# Altium schematic sheet Sheet2.SchDoc
size A; SheetNumber: 1; SheetTotal: 1
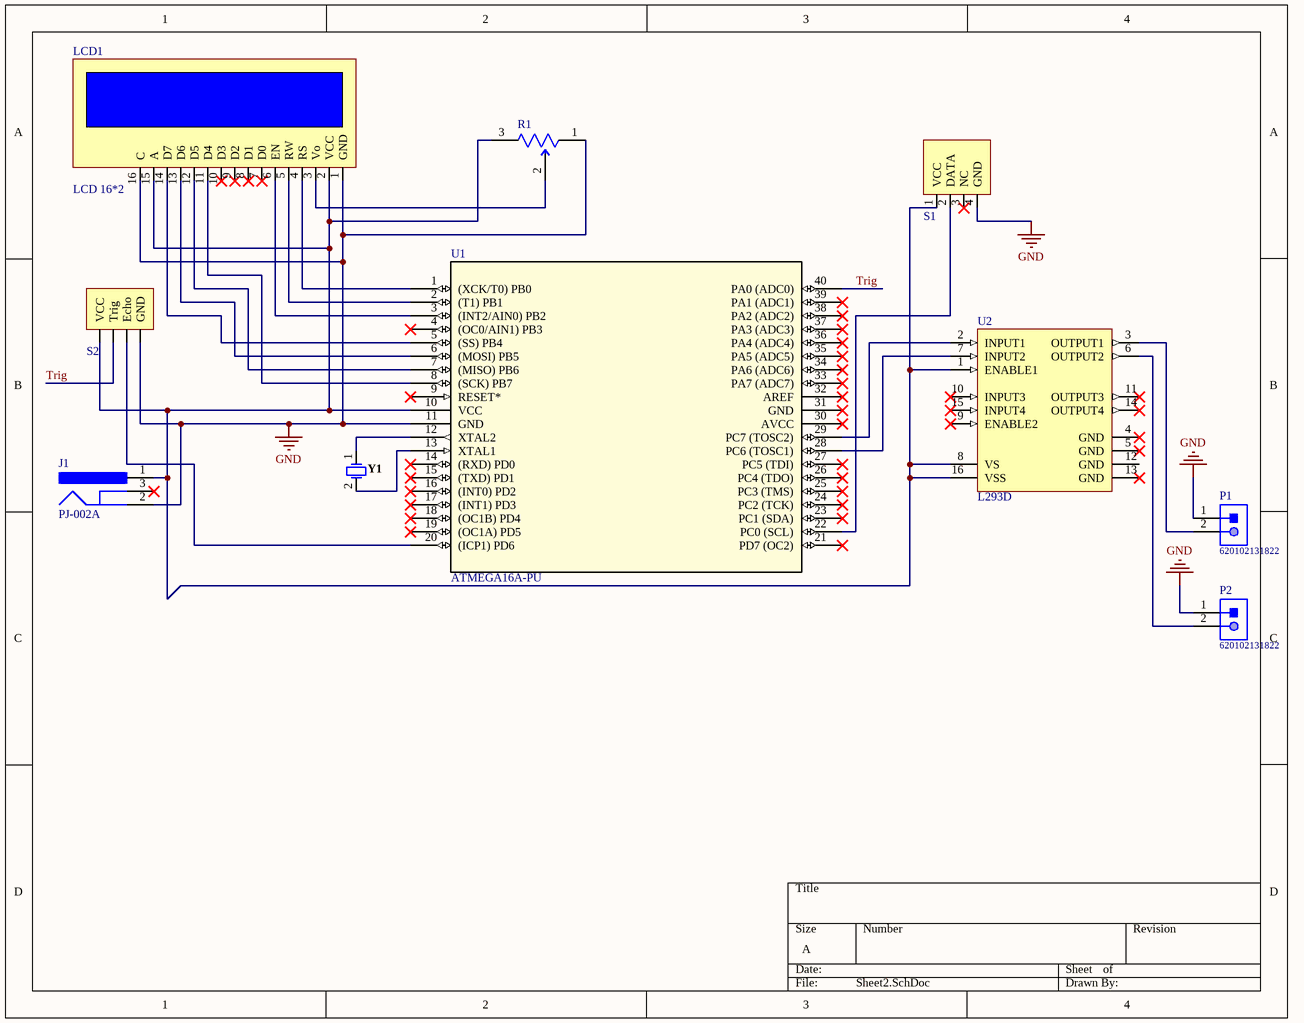
[diagram p0: Sheet2.SchDoc]

## Parts
J1  PJ-002A  [CUI-PJ-002A_V]
LCD1  LCD 16*2  [LCD1602]
P1  620102131822  [620102131822]
P2  620102131822  [620102131822]
R1  3006P-1-103LF  [FP-3006P-MFG]  (value not drawn)
S1  386  [DHT11]  (value not drawn)
S2  HC-SR04  [HC-SR04]  (value not drawn)
U1  ATMEGA16A-PU  [ATmega16A]
U2  L293D  [STM-L293D-16]
Y1  FOXSLF/080-20  [FOX-FOXSLF080-20]  (value not drawn)

## Nets
GND: J1.2 LCD1.1(GND) LCD1.16(C) P1.1 P2.1 R1.1(CCW) S1.4(GND) S2.4(GND) U1.11(GND)
Trig: S2.2(Trig) U1.40(PA0_(ADC0))
NetJ1_1: J1.1 LCD1.2(VCC) LCD1.15(A) R1.3(CW) S1.1(VCC) S2.1(VCC) U1.10(VCC) U2.1(ENABLE1) U2.8(VS) U2.16(VSS)
NetLCD1_3: LCD1.3(Vo) R1.2(WIPER)
NetLCD1_4: LCD1.4(RS) U1.1((XCK/T0)_PB0)
NetLCD1_5: LCD1.5(RW) U1.2((T1)_PB1)
NetLCD1_6: LCD1.6(EN) U1.3((INT2/AIN0)_PB2)
NetLCD1_11: LCD1.11(D4) U1.8((SCK)_PB7)
NetLCD1_12: LCD1.12(D5) U1.7((MISO)_PB6)
NetLCD1_13: LCD1.13(D6) U1.6((MOSI)_PB5)
NetLCD1_14: LCD1.14(D7) U1.5((SS)_PB4)
NetP1_2: P1.2 U2.3(OUTPUT1)
NetP2_2: P2.2 U2.6(OUTPUT2)
NetS1_2: S1.2(DATA) U1.22(PC0_(SCL))
NetS2_3: S2.3(Echo) U1.20((ICP1)_PD6)
NetU1_12: U1.12(XTAL2) Y1.1
NetU1_13: U1.13(XTAL1) Y1.2
NetU1_28: U1.28(PC6_(TOSC1)) U2.7(INPUT2)
NetU1_29: U1.29(PC7_(TOSC2)) U2.2(INPUT1)

Not connected (* = marked no-connect by the designer): J1 3*; LCD1 7(D0)* 8(D1)* 9(D2)* 10(D3)*; S1 3(NC)*; U1 4((OC0/AIN1)_PB3)* 9(RESET*)* 14((RXD)_PD0)* 15((TXD)_PD1)* 16((INT0)_PD2)* 17((INT1)_PD3)* 18((OC1B)_PD4)* 19((OC1A)_PD5)* 21(PD7_(OC2))* 23(PC1_(SDA))* 24(PC2_(TCK))* 25(PC3_(TMS))* 26(PC4_(TDO))* 27(PC5_(TDI))* 30(AVCC)* 31(GND)* 32(AREF)* 33(PA7_(ADC7))* 34(PA6_(ADC6))* 35(PA5_(ADC5))* 36(PA4_(ADC4))* 37(PA3_(ADC3))* 38(PA2_(ADC2))* 39(PA1_(ADC1))*; U2 4(GND)* 5(GND)* 9(ENABLE2)* 10(INPUT3)* 11(OUTPUT3)* 12(GND) 13(GND)* 14(OUTPUT4)* 15(INPUT4)*

## Library data of the parts
J1 = CMP-2000-06895-2: Through Hole Right Angle DC Power Jack, 2.5 A, 2 mm Center Pin, 3 Position, -25 to 85 degC, RoHS, Bulk; Manufacturer: CUIInc.; Brand: CUI; Inside Contact Diameter: 2mm; Voltage Rating: 24V; Outside Contact Diameter: 6.5mm; Current Rating: 2.5A; Insulation Resistance: 50MOhms; Contact Gender: Male; Connector Type: DCPowerJack; Datasheet Version: Rev. 1.03, 04/2016; Housing Material: PolybutyleneTerephthalate(PBT); Operating Temperature Range: -25Cto+85C; Termination Style: ThroughHole; Product Category: DCPowerConnectors; Mounting Technology: ThroughHole; Mounting Style: ThroughHole; Factory Pack Quantity: 500; Contact Plating: Nickel; Package Reference: PJ-002A; Mounting Angle: Right; Package Description: 3-Pin Through Hole Device, Body 14.4 x 9 mm, Height 11 mm; Flammability Rating: UL94V-0; Manufacturer URL: http://www.cui.com/; Product: Jacks; Contact Material: Copper; Datasheet URL: http://www.cui.com/product/resource/pj-002a.pdf; RoHS: True; Manufacturer: CUI; Manufacturer Part Number: PJ-002A
P1 P2 = CMP-1502-00669-1: Male Shrouded Header WR-WTB, SMT, Right Angled, pitch 2 mm, 1 x 2 position; Manufacturer: Wurth Elektronik; Manufacturer: Wurth Electronics; Position: 1x2; Working Voltage: 100VAC; Contact Resistance: 20mOhm; Pitch: 2mm; Packaging: TapeandReel; Part Number: 620102131822; Publisher: WurthElektronik; Mounting Technology: SMT; Manufacturer URL: http://www.we-online.de; Datasheet URL: https://katalog.we-online.de/em/datasheet/6201xx131822.pdf; Gender: Male; Operating Temperature: -25to85degC; Package Reference: 620102131822; Orientation: RightAngled; Manufacturer Part Number: 620102131822
R1 = CMP-07234-000047-1: TRIMMER 10KOHM 0.75W PC PIN SIDE; Manufacturer Series: 3006; Manufacturer: Bourns; Pin Diameter: 0.6mm; Resistance Tolerance: 10%; Actuator Type: SCREW; Number of Turns: 15; Insulation Resistance: 1GR; Pitch: 2.5mm; Power Rating: 750mW; Resistance Law: Linear; Temperature Coefficient: 100ppm/°C; Resistance: 10kR; Number of Terminals/Pins: 3; Actuator Orientation: Horizontal; Package Quantity: 100; Depth: 4.83mm; Width: 4.83mm; Termination: Pin; Packaging: Rail/Tube; Height: 6.35mm; Terminal Finish: Tin; Color: Blue; Thickness: 5.59mm; Lead Free: Lead Free; Min Operating Temperature: -55°C; Type: Potentiometer; Radiation Hardening: No; Weight: 0.04oz; Mount: Panel; RoHS Compliant: Yes; Length: 20.57mm; Tolerance: 10%; Number of Pins: 3; Taper: Linear; Military Standard: Not; Resistor Type: Cermet; Max Operating Temperature: 125°C; REACH SVHC: No SVHC; Technology: CERMET; Max Power Dissipation: 750mW; Series: 3006; Manufacturer Part Number: 3006P-1-103LF
S1 = 386: SENSOR HUMID/TEMP 5V DTL 5% MOD; Manufacturer: Adafruit Industries; Response Time: 1s; Sensor Type: Temperature; Output Type: Digital; Supplier 1: Arrow Electronics; Manufacturer Part Number: 386; RoHS: Yes; Category: Sensors; Stock 1: 15; Pricing 1: 1=5.00000 (USD); Mount: Chassis Mount; Min Operating Temperature: 0°C; Max Operating Temperature: 50°C; Series: -; Accuracy: 5%; ComponentLink1URL: https://media.digikey.com/pdf/Data%20Sheets/Adafruit%20PDFs/DHT11_ProdManual.pdf?src-supplier=Digi-Key; ComponentLink1Description: https://media.digikey.com/pdf/Data%20Sheets/Adafruit%20PDFs/DHT11_ProdManual.pdf?src-supplier=Digi-Key
S2 = HC-SR04: Ultrasonic Sensor Module, Rectangular, 20-4000 mm, 5 V, 15 mA, Arduino Compatible; Manufacturer: OSEPP; Supplier 1: Mouser; Manufacturer Part Number: HC-SR04; RoHS: Yes; Category: Sensors; Stock 1: 121; Pricing 1: 1=6.55000, 10=6.55000, 50=6.55000, 100=6.55000, 1000=6.55000, 10000=6.55000 (USD); ComponentLink1URL: http://www.alliedelec.com/m/d/24ef524bf2e055bb41c3e7d4403161f4.pdf?src-supplier=Allied+Electronics; ComponentLink1Description: http://www.alliedelec.com/m/d/24ef524bf2e055bb41c3e7d4403161f4.pdf?src-supplier=Allied+Electronics
U1 = ATMEGA16A-PU: 8-bit AVR MCU, 16 KB, 1024 Bytes, 16 MHz, 2.7 to 5.5V, PDIP-40, RoHS; Manufacturer: Microchip / Atmel; Frequency: 16MHz; Memory Type: FLASH; Memory Size: 16KB; Interface: I2C,SPI,UART,USART,2-Wire; RAM Size: 1KB; Min Supply Voltage: 2.7V; Number of I/Os: 32; Number of Timers/Counters: 3; Oscillator Type: Internal; Data Bus Width: 8b; Peripherals: Brown-out Detect/Reset,POR,PWM,WDT; Number of PWM Channels: 4; Number of ADC Channels: 8; Number of SPI Channels: 1; Watchdog Timer: Yes; Supplier 1: Newark; Manufacturer Part Number: ATMEGA16A-PU; RoHS: Yes; Category: Microcontrollers; Mount: Through Hole; Case/Package: PDIP; Number of Pins: 40; Contact Plating: Tin,Matte; Min Operating Temperature: -40°C; Max Operating Temperature: 85°C; Packaging: Rail/Tube; Core Architecture: AVR; Max Supply Voltage: 5.5V; Package Quantity: 10; Number of Programmable I/O: 32; Max Frequency: 16MHz; Series: AVR® ATmega; Number of I2C Channels: 1; Length: 52.58mm; Width: 13.97mm; Height: 4.445mm; Radiation Hardening: No; REACH SVHC: No SVHC; Lead Free: Lead Free; ComponentLink1URL: https://datasheet.ciiva.com/26860/getdatasheetpartid-464499-26860340.pdf?src-supplier=Verical; ComponentLink1Description: https://datasheet.ciiva.com/26860/getdatasheetpartid-464499-26860340.pdf?src-supplier=Verical; ComponentLink2URL: https://datasheet.ciiva.com/14633/0900766b80db4e44-14633395.pdf?src-supplier=Allied+Electronics; ComponentLink2Description: https://datasheet.ciiva.com/14633/0900766b80db4e44-14633395.pdf?src-supplier=Allied+Electronics; ComponentLink3URL: https://datasheet.ciiva.com/1157/466147-1157513.pdf?src-supplier=Element14; ComponentLink3Description: https://datasheet.ciiva.com/1157/466147-1157513.pdf?src-supplier=Element14
U2 = L293D: Push-Pull Four Channel Driver with Diode, 4.5 to 36 V, -40 to 150 degC, 16-Pin PDIP, RoHS, Tube; Manufacturer: STMicroelectronics; Number of Outputs: 4; Current - Peak Output: 1.2A; Current - Output / Channel: 600mA; Input Type: Non-Inverting; Other Related Documents: L293DViewAllSpecifications; Dynamic Catalog: HalfBridge; Voltage - Supply: 4.5V~36V; Other Names: 497-2936-5; Package / Case: 16-DIP(0.300",7.62mm); PartNumber: L293D; Operating Temperature: -40°C~150°C; Datasheet URL: http://www.st.com/st-web-ui/static/active/en/resource/technical/document/datasheet/CD00000059.pdf; Supplier Device Package: 16-PowerDIP; Packaging: Tube; Package Description: 16-Pin Thru-Hole Dual-In-Line, Body 20 x 6.85 mm, Pitch 2.54 mm; Standard Package: 25; Datasheet Version: 07/2003; On-State Resistance: -; Manufacturer URL: http://www.st.com/; Category: IntegratedCircuits(ICs); Family: PMIC-MOSFET,BridgeDrivers-InternalSwitch; Type: HalfBridge; Series: -; Mounting Technology: ThroughHole; Package Reference: DIP-16; Mounting Type: ThroughHole; Manufacturer Part Number: L293D
Y1 = CMP-1749-00002-1: Resistance Weld Thru-Hole Crystal, 8 MHz, -20 to 70 degC, 2-Pin THD, RoHS, Bulk; Manufacturer: Fox Electronics; Dropout Voltage: 2 V; Outputs: 1; Nominal Output Voltage: 5 V; Min Input Voltage: 7 V; Case\Package: TO-263-3; Max Input Voltage: 35 V; Max Ouput Current: 1 A; Length: 10.24 mm; Max Operating Temperature: 125 degC; Mount: Surface Mount; PackageDescription: 2-Pin Through Hole Device, Body 11.35 x 4.65 mm; Package Quantity: 50; Pins: 3; ComponentLink2URL: http://download.siliconexpert.com/pdfs/2015/4/5/6/5/7/200/fox_/manual/35607121449963728hc49slf.pdf; PackageReference: FOXSLF080-20; Min Operating Temperature: 0 degC; Height: 30.02 mm; Packaging: Rail/Tube; Radiation Hardening: No; Width: 9.35 mm; ComponentLink1URL: http://www.foxonline.com/; DatasheetVersion: Mar-15; ComponentLink1Description: Manufacturer URL; Output Voltage: 5 V; RoHSCompliant: true; REACH SVHC: No SVHC; Output Current: 1 A; ComponentLink2Description: Datasheet; Manufacturer Part Number: FOXSLF/080-20